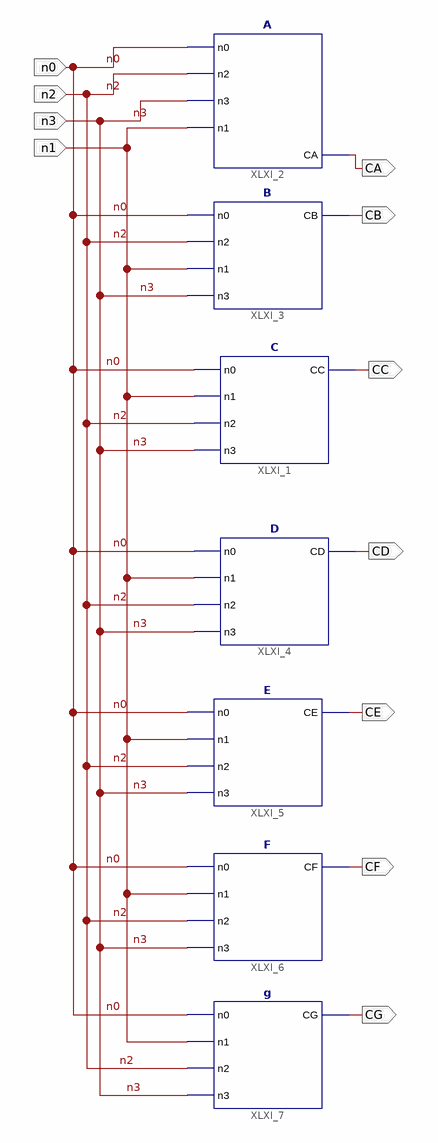
[diagram p0: schematic sheet 1]
// Xilinx ISE schematic Segment.sch (spartan3e) as structural Verilog: 7 symbols, 11 ports
module Segment (
  input  n0,
  input  n2,
  input  n3,
  input  n1,
  output CA,
  output CB,
  output CC,
  output CD,
  output CE,
  output CF,
  output CG
);

  C XLXI_1 (.n0(n0), .n1(n1), .n2(n2), .n3(n3), .CC(CC));
  A XLXI_2 (.n0(n0), .n2(n2), .n3(n3), .n1(n1), .CA(CA));
  B XLXI_3 (.n0(n0), .n2(n2), .n1(n1), .n3(n3), .CB(CB));
  D XLXI_4 (.n0(n0), .n1(n1), .n2(n2), .n3(n3), .CD(CD));
  E XLXI_5 (.n0(n0), .n1(n1), .n2(n2), .n3(n3), .CE(CE));
  F XLXI_6 (.n0(n0), .n1(n1), .n2(n2), .n3(n3), .CF(CF));
  g XLXI_7 (.n0(n0), .n1(n1), .n2(n2), .n3(n3), .CG(CG));
endmodule
